# EAGLE schematic address_decoder_v2 (EAGLE 9.2.2)

## Sheet 1 of 2
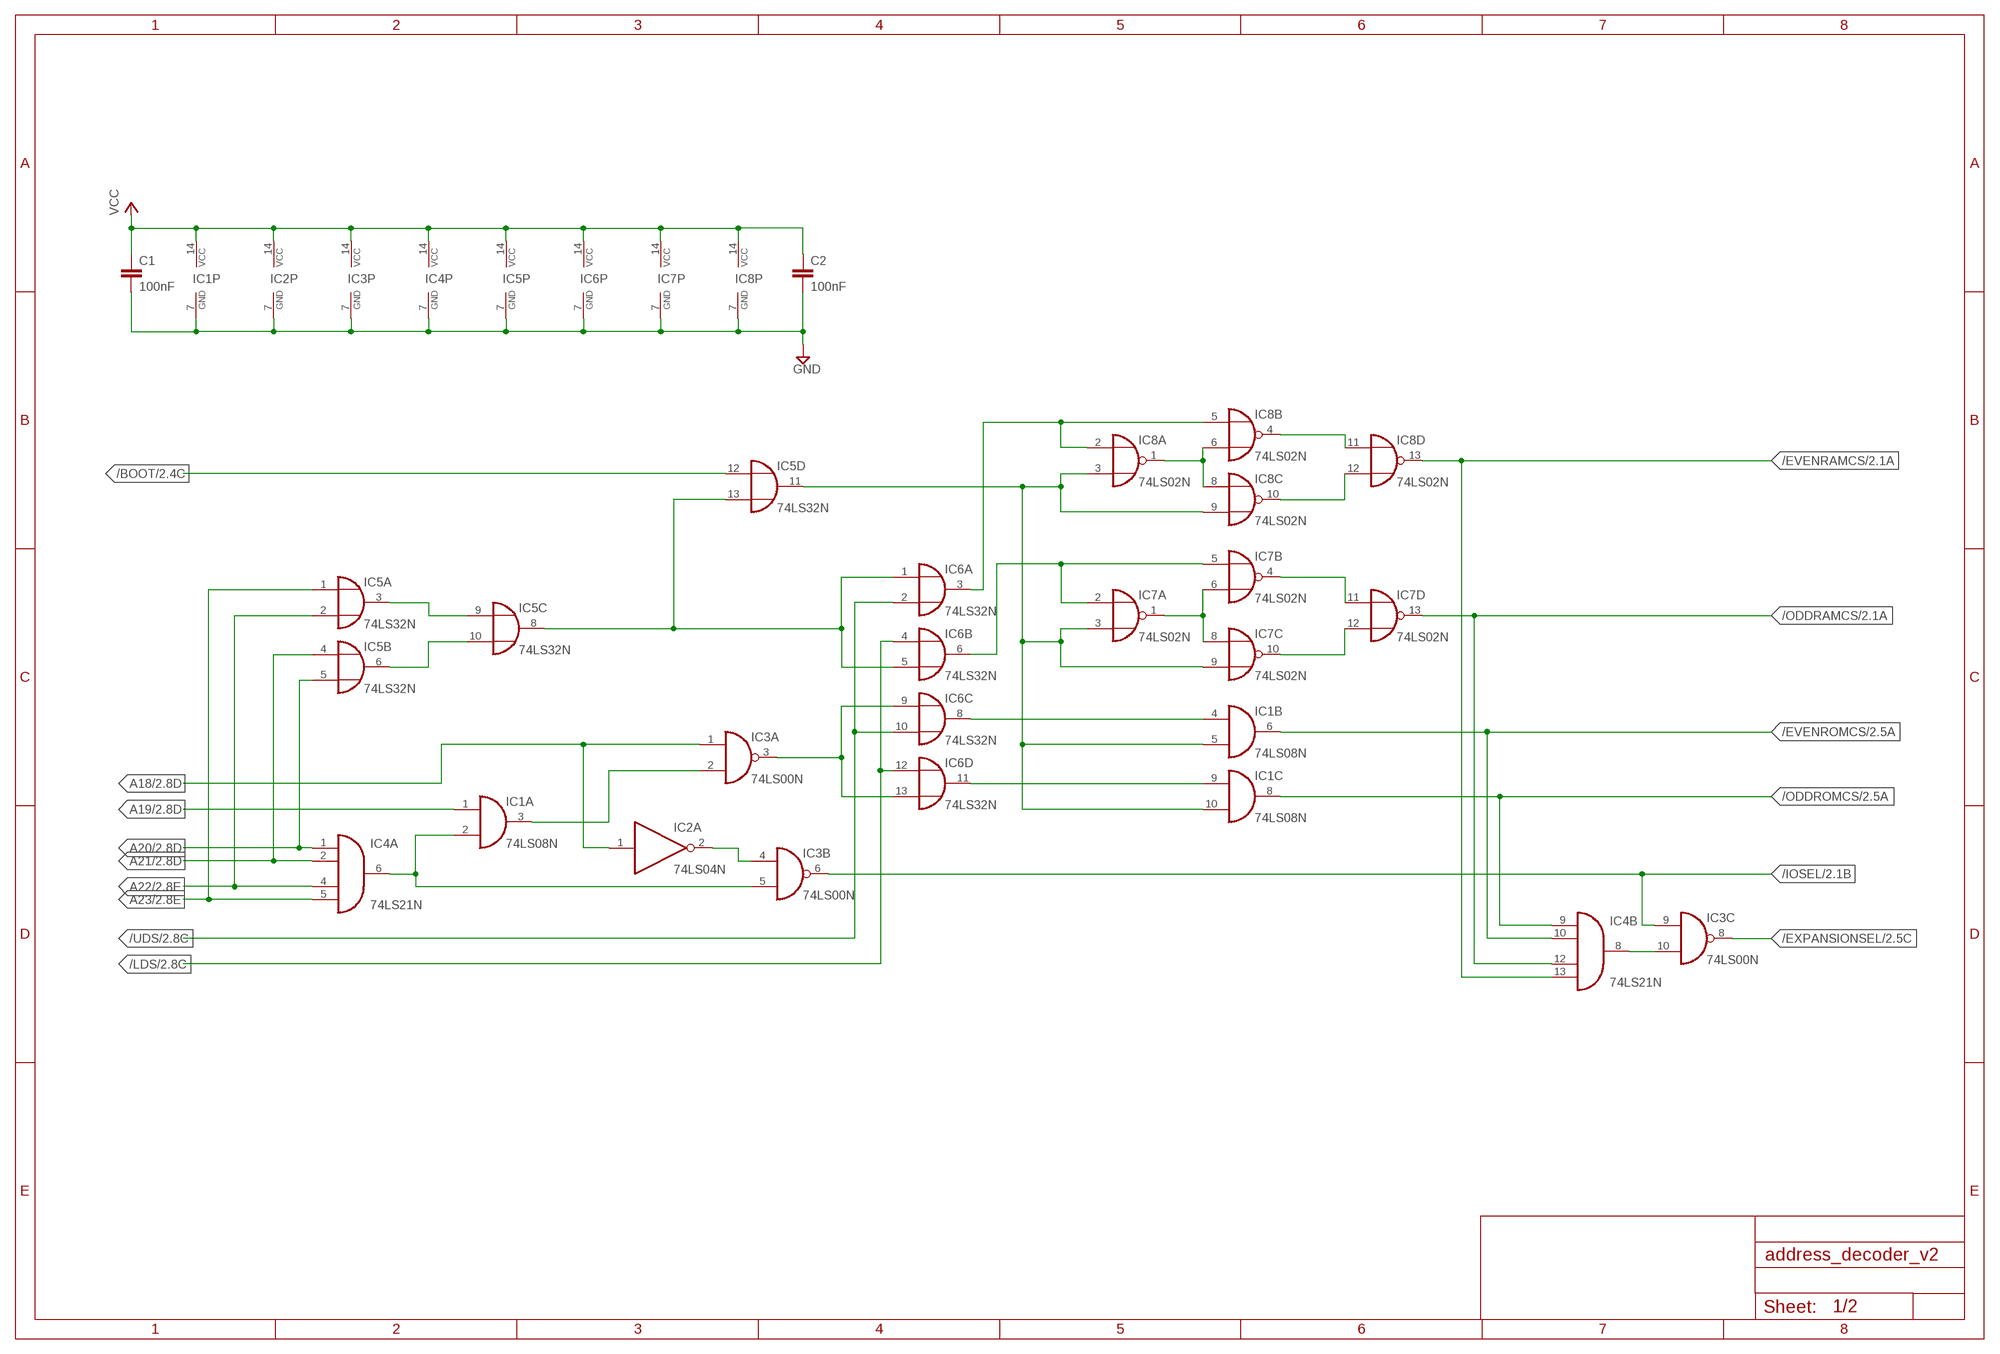
[diagram p0: schematic, sheet 1]

### Parts
C1  100nF  C-EU025-024X044  [C025-024X044]
C2  100nF  C-EU025-024X044  [C025-024X044]
IC1  74LS08N  [DIL14]
IC2  74LS04N  [DIL14]
IC3  74LS00N  [DIL14]
IC4  74LS21N  [DIL14]
IC5  74LS32N  [DIL14]
IC6  74LS32N  [DIL14]
IC7  74LS02N  [DIL14]
IC8  74LS02N  [DIL14]

### Nets
/BOOT: IC5.12(D:I0) ; also sheet 2
/EVENRAMCS: IC4.13(B:I3) IC8.13(D:O) ; also sheet 2
/EVENROMCS: IC1.6(B:O) IC4.10(B:I1) ; also sheet 2
/EXPANSIONSEL: IC3.8(C:O) ; also sheet 2
/IOSEL: IC3.6(B:O) IC3.9(C:I0) ; also sheet 2
/LDS: IC6.4(B:I0) IC6.12(D:I0) ; also sheet 2
/ODDRAMCS: IC4.12(B:I2) IC7.13(D:O) ; also sheet 2
/ODDROMCS: IC1.8(C:O) IC4.9(B:I0) ; also sheet 2
/UDS: IC6.2(A:I1) IC6.10(C:I1) ; also sheet 2
A18: IC2.1(A:I) IC3.1(A:I0) ; also sheet 2
A19: IC1.1(A:I0) ; also sheet 2
A20: IC4.1(A:I0) IC5.5(B:I1) ; also sheet 2
A21: IC4.2(A:I1) IC5.4(B:I0) ; also sheet 2
A22: IC4.4(A:I2) IC5.2(A:I1) ; also sheet 2
A23: IC4.5(A:I3) IC5.1(A:I0) ; also sheet 2
GND: C1.2 C2.2 IC1.7(P:GND) IC2.7(P:GND) IC3.7(P:GND) IC4.7(P:GND) IC5.7(P:GND) IC6.7(P:GND) IC7.7(P:GND) IC8.7(P:GND) ; also sheet 2
N$1: IC8.1(A:O) IC8.6(B:I1) IC8.8(C:I0)
N$2: IC8.4(B:O) IC8.11(D:I0)
N$3: IC8.10(C:O) IC8.12(D:I1)
N$4: IC6.3(A:O) IC8.2(A:I0) IC8.5(B:I0)
N$5: IC3.10(C:I1) IC4.8(B:O)
N$6: IC7.1(A:O) IC7.6(B:I1) IC7.8(C:I0)
N$7: IC7.4(B:O) IC7.11(D:I0)
N$8: IC6.6(B:O) IC7.2(A:I0) IC7.5(B:I0)
N$9: IC1.5(B:I1) IC1.10(C:I1) IC5.11(D:O) IC7.3(A:I1) IC7.9(C:I1) IC8.3(A:I1) IC8.9(C:I1)
N$10: IC7.10(C:O) IC7.12(D:I1)
N$11: IC1.4(B:I0) IC6.8(C:O)
N$12: IC1.9(C:I0) IC6.11(D:O)
N$13: IC5.3(A:O) IC5.9(C:I0)
N$14: IC5.6(B:O) IC5.10(C:I1)
N$17: IC3.3(A:O) IC6.9(C:I0) IC6.13(D:I1)
N$18: IC1.2(A:I1) IC3.5(B:I1) IC4.6(A:O)
N$19: IC2.2(A:O) IC3.4(B:I0)
N$20: IC5.8(C:O) IC5.13(D:I1) IC6.1(A:I0) IC6.5(B:I1)
N$21: IC1.3(A:O) IC3.2(A:I1)
VCC: C1.1 C2.1 IC1.14(P:VCC) IC2.14(P:VCC) IC3.14(P:VCC) IC4.14(P:VCC) IC5.14(P:VCC) IC6.14(P:VCC) IC7.14(P:VCC) IC8.14(P:VCC) ; also sheet 2
Unconnected: IC1.11(D:O) IC1.12(D:I0) IC1.13(D:I1) IC2.3(B:I) IC2.4(B:O) IC2.5(C:I) IC2.6(C:O) IC2.8(D:O) IC2.9(D:I) IC2.10(E:O) IC2.11(E:I) IC2.12(F:O) IC2.13(F:I) IC3.11(D:O) IC3.12(D:I0) IC3.13(D:I1)

## Sheet 2 of 2
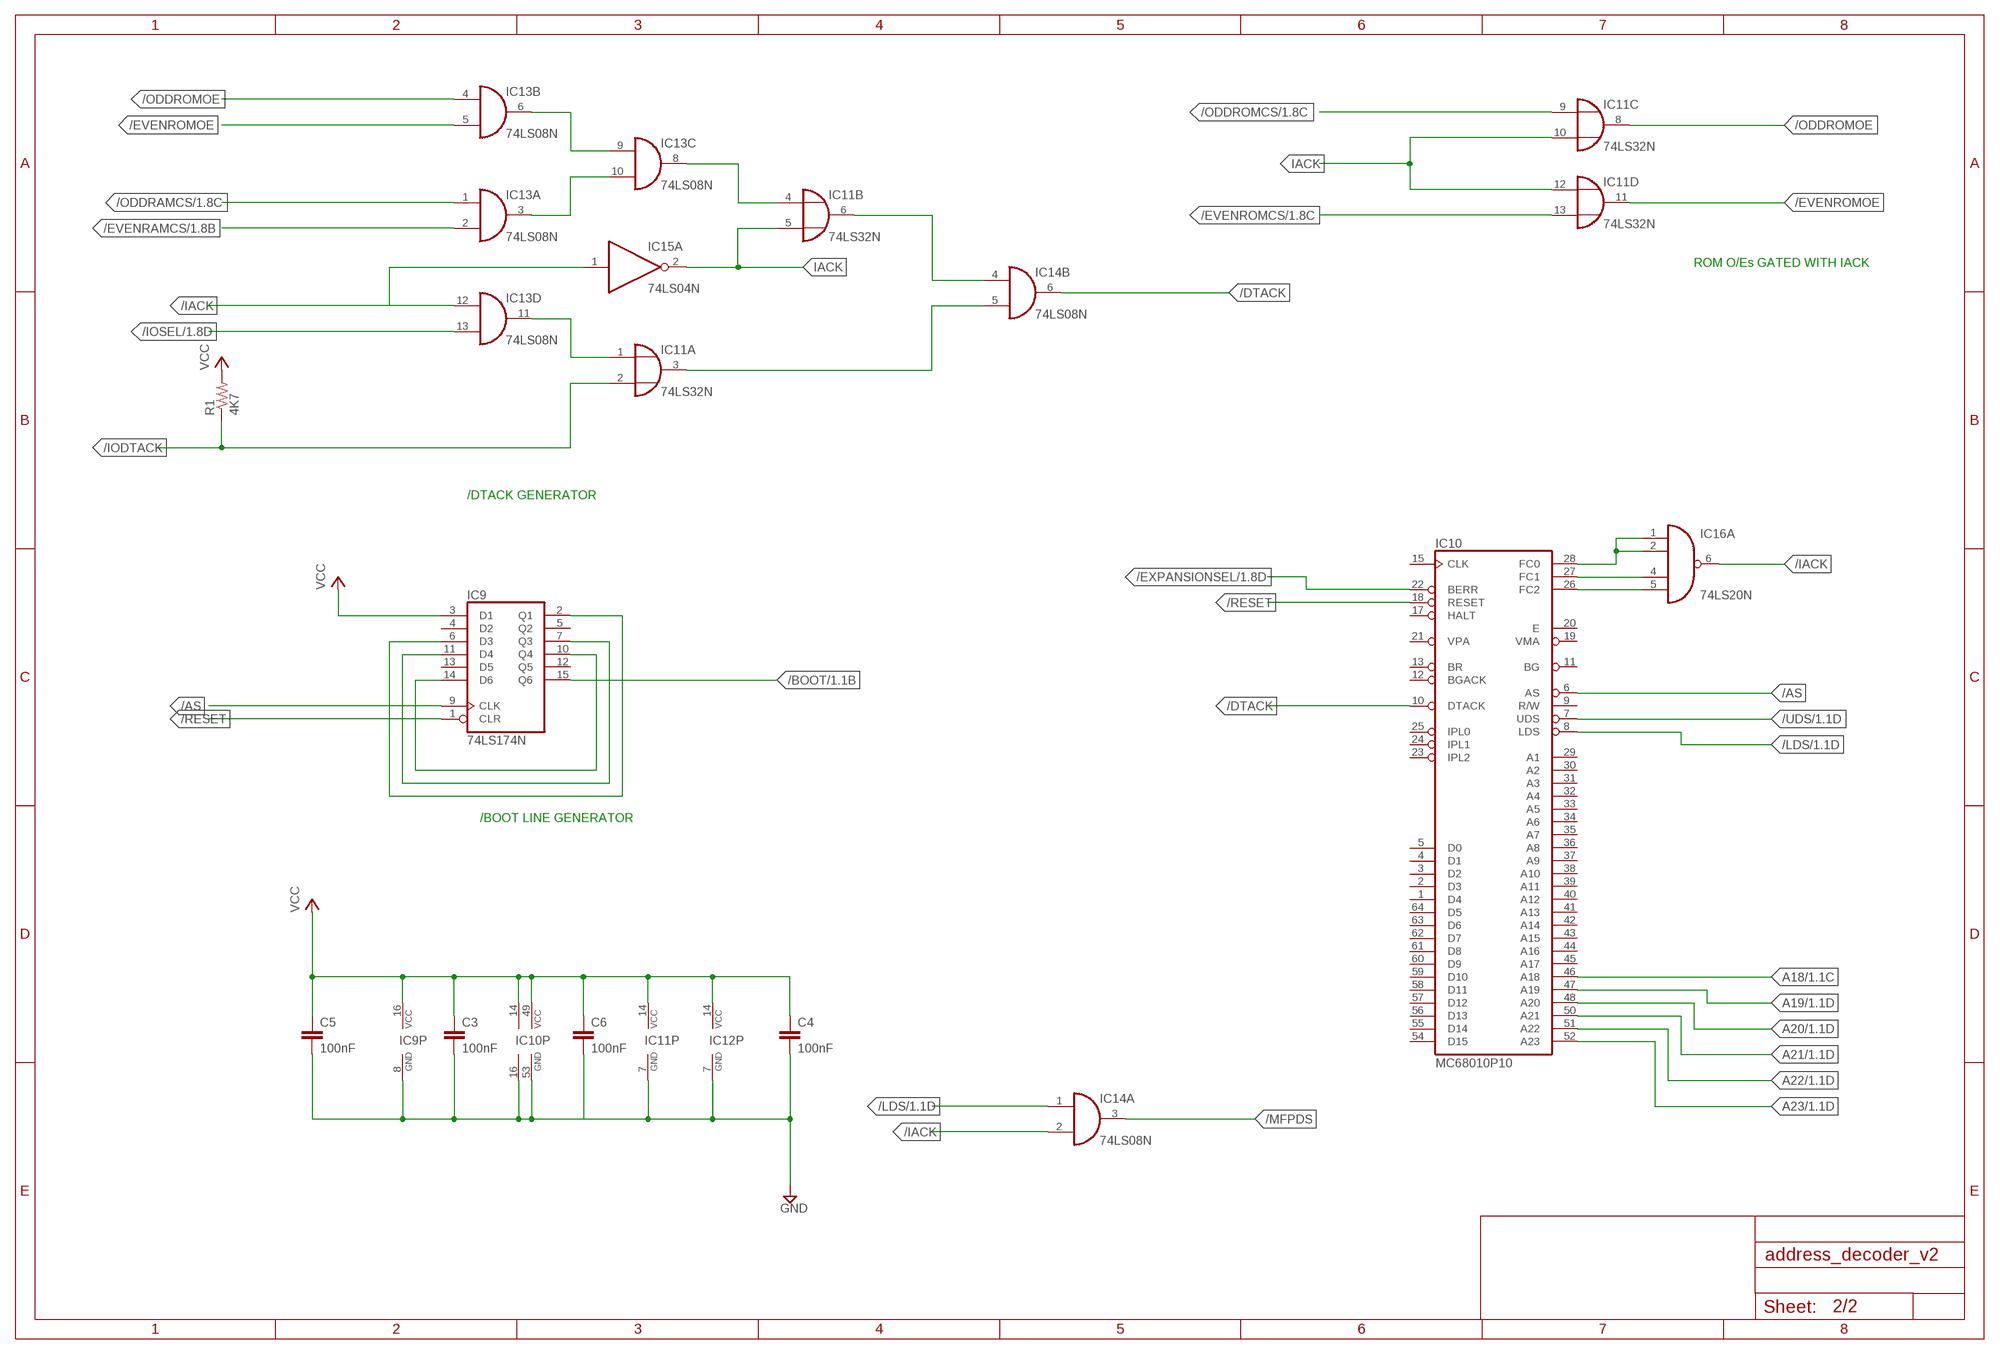
[diagram p1: schematic, sheet 2]

### Parts
C3  100nF  C5/3  [C5B3]
C4  100nF  C5/3  [C5B3]
C5  100nF  C5/3  [C5B3]
C6  100nF  C5/3  [C5B3]
IC9  74LS174N  [DIL16]
IC10  MC68010P10  MC68000P  [DIL64]
IC11  74LS32N  [DIL14]
IC12  74LS21N  [DIL14]
IC13  74LS08N  [DIL14]
IC14  74LS08N  [DIL14]
IC15  74LS04N  [DIL14]
IC16  74LS20N  [DIL14]
R1  4K7  R-US_0204/7  [0204/7]

### Nets
/AS: IC9.9(CLK) IC10.6(AS)
/BOOT: IC9.15(Q6) ; also sheet 1
/DTACK: IC10.10(DTACK) IC14.6(B:O)
/EVENRAMCS: IC13.2(A:I1) ; also sheet 1
/EVENROMCS: IC11.13(D:I1) ; also sheet 1
/EVENROMOE: IC11.11(D:O) IC13.5(B:I1)
/EXPANSIONSEL: IC10.22(BERR) ; also sheet 1
/IACK: IC13.12(D:I0) IC14.2(A:I1) IC15.1(A:I) IC16.6(A:O)
/IODTACK: IC11.2(A:I1) R1.1
/IOSEL: IC13.13(D:I1) ; also sheet 1
/LDS: IC10.8(LDS) IC14.1(A:I0) ; also sheet 1
/MFPDS: IC14.3(A:O)
/ODDRAMCS: IC13.1(A:I0) ; also sheet 1
/ODDROMCS: IC11.9(C:I0) ; also sheet 1
/ODDROMOE: IC11.8(C:O) IC13.4(B:I0)
/RESET: IC9.1(CLR) IC10.18(RESET)
/UDS: IC10.7(UDS) ; also sheet 1
A18: IC10.46(A18) ; also sheet 1
A19: IC10.47(A19) ; also sheet 1
A20: IC10.48(A20) ; also sheet 1
A21: IC10.50(A21) ; also sheet 1
A22: IC10.51(A22) ; also sheet 1
A23: IC10.52(A23) ; also sheet 1
GND: C3.2 C4.2 C5.2 IC9.8(GND) IC10.16(GND) IC10.53(GND) IC11.7(P:GND) IC12.7(P:GND) ; also sheet 1
GND1: C6.2
IACK: IC11.5(B:I1) IC11.10(C:I1) IC11.12(D:I0) IC15.2(A:O)
N$15: IC13.6(B:O) IC13.9(C:I0)
N$16: IC9.7(Q3) IC9.11(D4)
N$22: IC9.10(Q4) IC9.14(D6)
N$23: IC9.2(Q1) IC9.6(D3)
N$24: IC13.3(A:O) IC13.10(C:I1)
N$25: IC11.4(B:I0) IC13.8(C:O)
N$27: IC11.1(A:I0) IC13.11(D:O)
N$28: IC11.6(B:O) IC14.4(B:I0)
N$29: IC11.3(A:O) IC14.5(B:I1)
N$30: IC10.26(FC2) IC16.5(A:I3)
N$31: IC10.27(FC1) IC16.4(A:I2)
N$32: IC10.28(FC0) IC16.1(A:I0) IC16.2(A:I1)
VCC: C3.1 C4.1 C5.1 C6.1 IC9.3(D1) IC9.16(VCC) IC10.14(VCC) IC10.49(VCC) IC11.14(P:VCC) IC12.14(P:VCC) R1.2 ; also sheet 1
Unconnected: IC9.4(D2) IC9.5(Q2) IC9.12(Q5) IC9.13(D5) IC10.1(D4) IC10.2(D3) IC10.3(D2) IC10.4(D1) IC10.5(D0) IC10.9(R/W) IC10.11(BG) IC10.12(BGACK) IC10.13(BR) IC10.15(CLK) IC10.17(HALT) IC10.19(VMA) IC10.20(E) IC10.21(VPA) IC10.23(IPL2) IC10.24(IPL1) IC10.25(IPL0) IC10.29(A1) IC10.30(A2) IC10.31(A3) IC10.32(A4) IC10.33(A5) IC10.34(A6) IC10.35(A7) IC10.36(A8) IC10.37(A9) IC10.38(A10) IC10.39(A11) IC10.40(A12) IC10.41(A13) IC10.42(A14) IC10.43(A15) IC10.44(A16) IC10.45(A17) IC10.54(D15) IC10.55(D14) IC10.56(D13) IC10.57(D12) IC10.58(D11) IC10.59(D10) IC10.60(D9) IC10.61(D8) IC10.62(D7) IC10.63(D6) IC10.64(D5) IC12.1(A:I0) IC12.2(A:I1) IC12.4(A:I2) IC12.5(A:I3) IC12.6(A:O) IC12.8(B:O) IC12.9(B:I0) IC12.10(B:I1) IC12.12(B:I2) IC12.13(B:I3) IC14.8(C:O) IC14.9(C:I0) IC14.10(C:I1) IC14.11(D:O) IC14.12(D:I0) IC14.13(D:I1) IC15.3(B:I) IC15.4(B:O) IC15.5(C:I) IC15.6(C:O) IC15.8(D:O) IC15.9(D:I) IC15.10(E:O) IC15.11(E:I) IC15.12(F:O) IC15.13(F:I) IC16.8(B:O) IC16.9(B:I0) IC16.10(B:I1) IC16.12(B:I2) IC16.13(B:I3)

### Notes on the sheet
- ROM O/Es GATED WITH IACK
- /DTACK GENERATOR
- /BOOT LINE GENERATOR

## Power pins joined to a net without a drawn wire
GND: IC13.7(P:GND) IC14.7(P:GND) IC15.7(P:GND) IC16.7(P:GND)
VCC: IC13.14(P:VCC) IC14.14(P:VCC) IC15.14(P:VCC) IC16.14(P:VCC)

## Library data of the parts
C1 C2 = rcl:C-EU: CAPACITOR, European symbol; SPICEPREFIX: C
C3-C6 = capacitor-wima:C: CAPACITOR naming: grid - package width
IC1 = 74xx-eu:74*08: Quad 2-input AND gate; SPICEPREFIX: I
IC2 = 74xx-eu:74*04: Hex INVERTER; SPICEPREFIX: I
IC3 = 74xx-eu:74*00: Quad 2-input NAND gate
IC4 = 74xx-eu:74*21: Dual 4-input AND gate; SPICEPREFIX: X
IC5 = 74xx-eu:74*32: Quad 2-input OR gate; SPICEPREFIX: J
IC6 IC11 = 74xx-eu:74*32: Quad 2-input OR gate
IC7 IC8 = 74xx-eu:74*02: Quad 2-input NOR gate
IC9 = 74xx-eu:74*174: Hex D type FLIP FLOP, clear
IC10 = micro-mc68000:MC68000P: 68xxx PROCESSOR; OC_FARNELL: unknown; OC_NEWARK: unknown
IC12 = 74xx-eu:74*21: Dual 4-input AND gate
IC13 IC14 = 74xx-eu:74*08: Quad 2-input AND gate
IC15 = 74xx-eu:74*04: Hex INVERTER
IC16 = 74xx-eu:74*20: Dual 4-input NAND gate
R1 = rcl:R-US_: RESISTOR, American symbol; SPICEPREFIX: R